# EAGLE design LT328v2 (EAGLE 7.5.0)
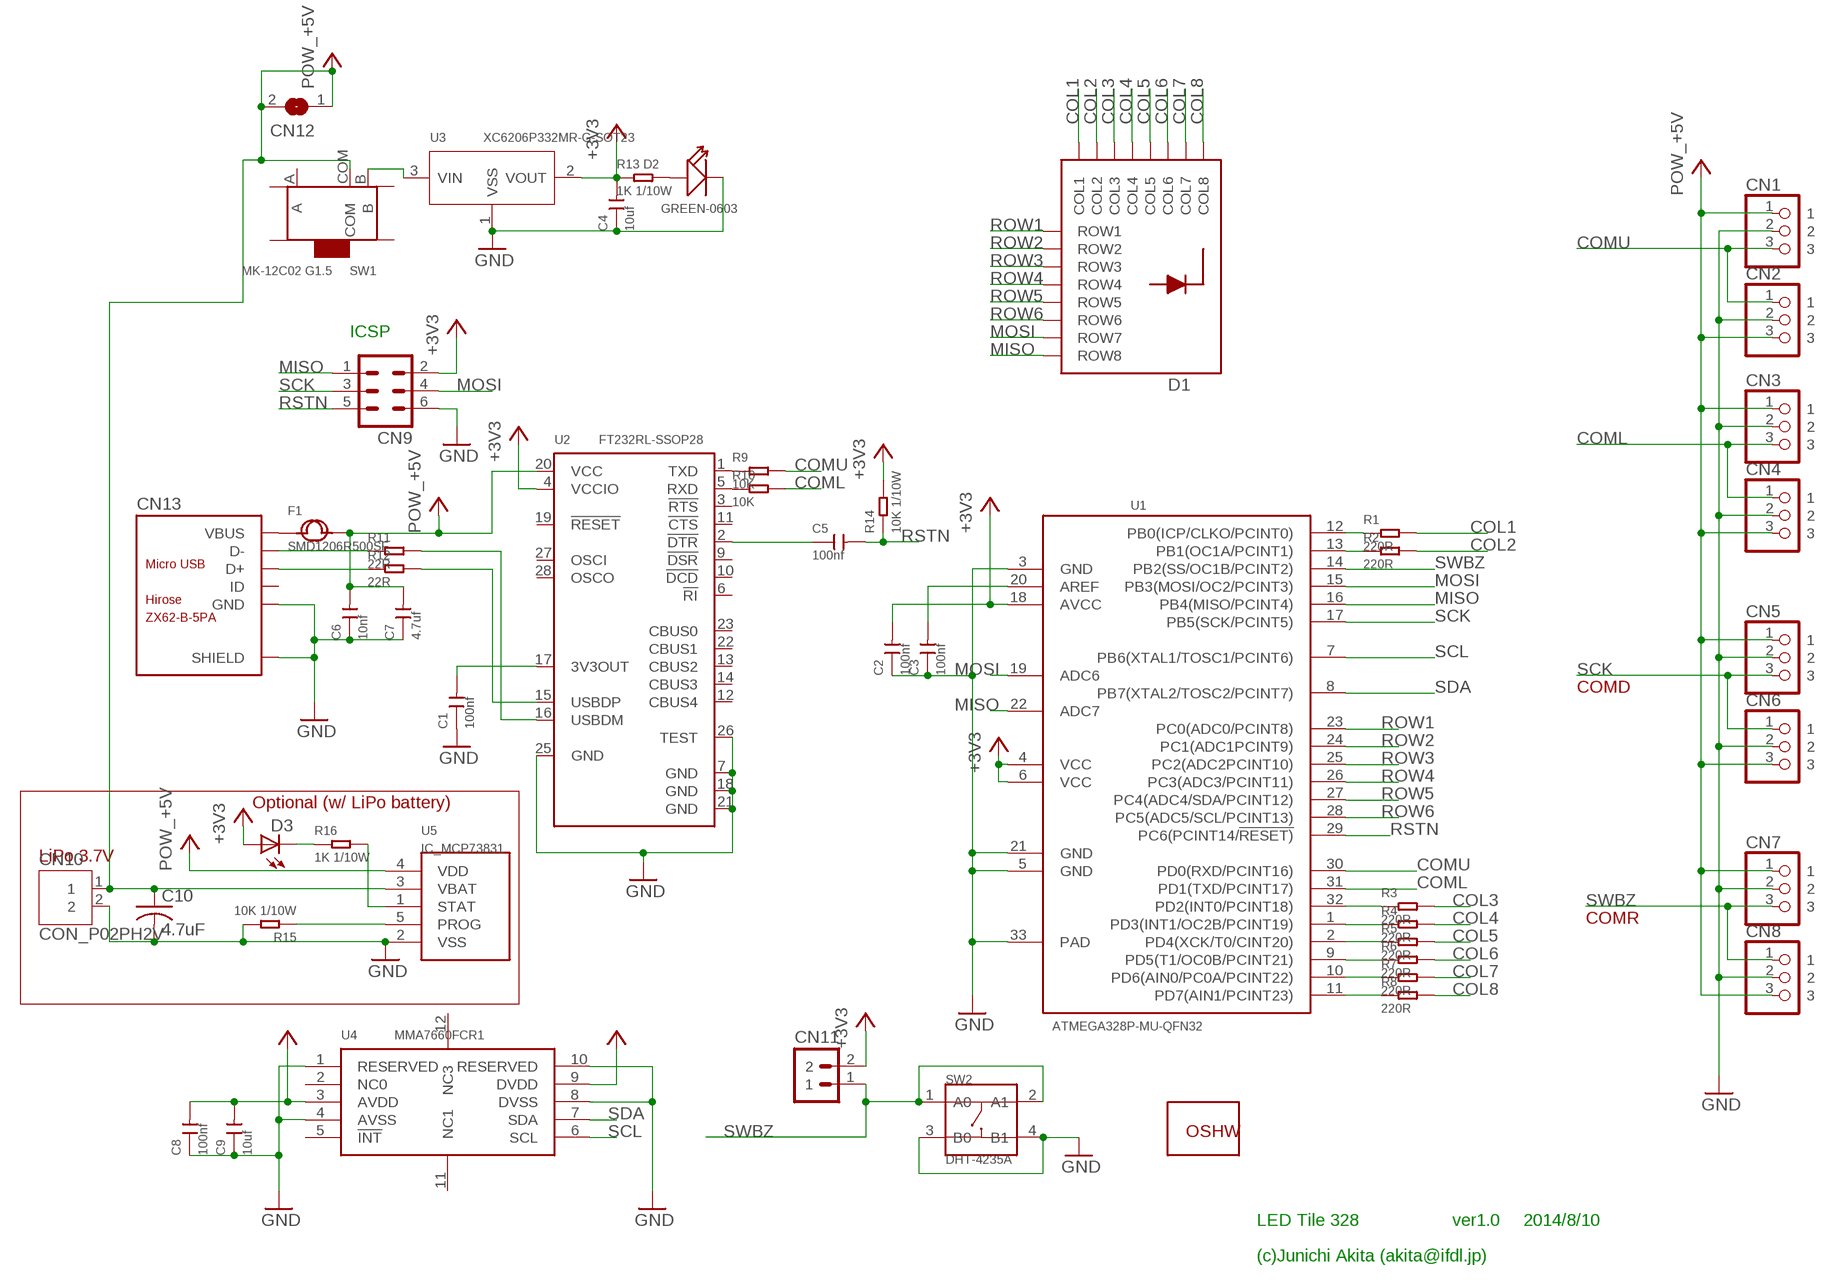
[diagram p0: schematic, sheet 1]

## Parts
C1  100nf  CERAMIC-100NF-50V-10%-X7R(0603)  [C0603]
C2  100nf  CERAMIC-100NF-50V-10%-X7R(0603)  [C0603]
C3  100nf  CERAMIC-100NF-50V-10%-X7R(0603)  [C0603]
C4  10uf  CERAMIC-10UF-10V-(-20%～+80%)-Y5V(0805)  [C0805]
C5  100nf  CERAMIC-100NF-50V-10%-X7R(0603)  [C0603]
C6  10nf  CERAMIC-10NF-50V-10%-X7R(0603)  [C0603]
C7  4.7uf  CERAMIC-4.7UF-10V-10%-X5R(0603)  [C0603]
C8  100nf  CERAMIC-100NF-50V-10%-X7R(0603)  [C0603]
C9  10uf  CERAMIC-10UF-10V-(-20%～+80%)-Y5V(0805)  [C0805]
C10  4.7uF  C-USC0603  [C0603]
CN1  CON_PINHD-1X3R  [1X03R]
CN2  CON_PINHD-1X3R  [1X03R]
CN3  CON_PINHD-1X3R  [1X03R]
CN4  CON_PINHD-1X3R  [1X03R]
CN5  CON_PINHD-1X3R  [1X03R]
CN6  CON_PINHD-1X3R  [1X03R]
CN7  CON_PINHD-1X3R  [1X03R]
CN8  CON_PINHD-1X3R  [1X03R]
CN9  MA03-2  [MA03-2]
CN10  CON_P02PH2V  [JST-PH2]
CN11  CON_PINHD-1X2PTH  [SPARKFUN_1X02]
CN12  JUMPER_SJ  [JUMPER_SJ]
CN13  ZX62-B-5PA  MICRO-USB-SMD(ZX62-B-5PA)  [MICRO-USB5+6P-SMD-0.65-AB]
D1  LED_OSL641501BRA  [TOM-1588BH]
D2  GREEN-0603  SMD-LED-CLEAR-GREEN(0603)  [LED-0603]
D3  LED0603  [SPARKFUN_LED-0603]
F1  SMD1206R500SF  SMD-PPTC-500MA(1206)  [F1206]
GOLD_ORB_SM1  OSHWLOGO_GOLD_ORB_SM  [OSHW2]
R1  220R  SMD-RES-220R-5%-1/10W(0603)  [R0603]
R2  220R  SMD-RES-220R-5%-1/10W(0603)  [R0603]
R3  220R  SMD-RES-220R-5%-1/10W(0603)  [R0603]
R4  220R  SMD-RES-220R-5%-1/10W(0603)  [R0603]
R5  220R  SMD-RES-220R-5%-1/10W(0603)  [R0603]
R6  220R  SMD-RES-220R-5%-1/10W(0603)  [R0603]
R7  220R  SMD-RES-220R-5%-1/10W(0603)  [R0603]
R8  220R  SMD-RES-220R-5%-1/10W(0603)  [R0603]
R9  10K  SMD-RES-10K-1%-1/10W(0603)  [R0603]
R10  10K  SMD-RES-10K-1%-1/10W(0603)  [R0603]
R11  22R  SMD-RES-22R-5%-1/10W(0603)  [R0603]
R12  22R  SMD-RES-22R-5%-1/10W(0603)  [R0603]
R13  1K 1/10W  SMD-RES-1K-5%-1/10W(0603)  [R0603]
R14  10K 1/10W  SMD-RES-10K-5%-1/10W(0603)  [R0603]
R15  10K 1/10W  SMD-RES-10K-5%-1/10W(0603)  [R0603]
R16  1K 1/10W  SMD-RES-1K-5%-1/10W(0603)  [R0603]
SW1  MK-12C02 G1.5  SMD-TOGGLE-SWITCH-ON-ON(3+4P-6.7X2.7MM)  [SW7-SMD-L6.7X2.7X3.2MM]
SW2  DHT-4235A  SMD-BUTTON-TOP-DHT-4235A(4P-4.2X3.2MM)  [SW4-SMD-4.2X3.2X2.5MM]
U1  ATMEGA328P-MU-QFN32  MCU-ATMEGA328P-MU(QFN32)  [QFN32G-0.5-5X5MM]
U2  FT232RL-SSOP28  INTERFACE-FT232RL(SSOP28)  [SSOP28-0.65-10.2X5.2MM]
U3  XC6206P332MR-G-SOT23  PMIC-LDO-XC6206P332MR-G(SOT23)  [SOT-23]
U4  MMA7660FCR1  MOTION/POSITION-MMA7660FCR1(DFN10)  [DFN10-0.5-3.0X3.0MM]
U5  IC_MCP73831  [SOT23-5L]

## Nets
+3V3: C2.2 C4.2 C8.2 C9.2 CN9.2 CN11.2 D3.A R13.1 R14.2 U1.4(VCC) U1.6(VCC) U1.18(AVCC) U2.4(VCCIO) U3.2(VOUT) U4.3(AVDD) U4.9(DVDD)
+5V: C6.2 C7.2 C10.1 CN1.1 CN2.3 CN3.1 CN4.3 CN5.1 CN6.3 CN7.1 CN8.3 CN10.1 CN12.1 CN12.2 F1.2 SW1.COM U2.20(VCC) U5.3(VBAT) U5.4(VDD) ; supply symbol labelled POW_+5V
COL1: D1.P$13(COL1) R1.2
COL2: D1.P$3(COL2) R2.2
COL3: D1.P$4(COL3) R3.2
COL4: D1.P$10(COL4) R4.2
COL5: D1.P$6(COL5) R5.2
COL6: D1.P$11(COL6) R6.2
COL7: D1.P$15(COL7) R7.2
COL8: D1.P$16(COL8) R8.2
COML: CN3.3 CN4.1 R10.2 U1.31(PD1(TXD/PCINT17))
COMU: CN1.3 CN2.1 R9.2 U1.30(PD0(RXD/PCINT16))
GND: C1.1 C2.1 C3.1 C4.1 C6.1 C7.1 C8.1 C9.1 C10.2 CN1.2 CN2.2 CN3.2 CN4.2 CN5.2 CN6.2 CN7.2 CN8.2 CN9.6 CN10.2 CN13.5(GND) CN13.P1(SHIELD) CN13.P2(SHIELD) CN13.P3(SHIELD) CN13.P4(SHIELD) CN13.P5(SHIELD) CN13.P6(SHIELD) D2.- R15.2 SW2.3(B0) SW2.4(B1) U1.3(GND) U1.5(GND) U1.21(GND) U1.33(PAD) U2.7(GND) U2.18(GND) U2.21(GND) U2.25(GND) U2.26(TEST) U3.1(VSS) U4.1(RESERVED) U4.4(AVSS) U4.8(DVSS) U4.10(RESERVED) U5.2(VSS)
MISO: CN9.1 D1.P$5(ROW8) U1.16(PB4(MISO/PCINT4)) U1.22(ADC7)
MOSI: CN9.4 D1.P$2(ROW7) U1.15(PB3(MOSI/OC2/PCINT3)) U1.19(ADC6)
N$1: SW1.B U3.3(VIN)
N$2: R11.2 U2.16(USBDM)
N$3: R12.2 U2.15(USBDP)
N$4: R9.1 U2.1(TXD)
N$5: C5.1 U2.2(!DTR)
N$6: C3.2 U1.20(AREF)
N$8: R10.1 U2.5(RXD)
N$9: D3.C R16.1
N$10: R16.2 U5.1(STAT)
N$11: C1.2 U2.17(3V3OUT)
N$12: D2.+ R13.2
N$13: R8.1 U1.11(PD7(AIN1/PCINT23))
N$14: R7.1 U1.10(PD6(AIN0/PC0A/PCINT22))
N$15: R6.1 U1.9(PD5(T1/OC0B/PCINT21))
N$16: R5.1 U1.2(PD4(XCK/T0/CINT20))
N$17: R4.1 U1.1(PD3(INT1/OC2B/PCINT19))
N$18: R3.1 U1.32(PD2(INT0/PCINT18))
N$20: R1.1 U1.12(PB0(ICP/CLKO/PCINT0))
N$21: R2.1 U1.13(PB1(OC1A/PCINT1))
N$25: CN13.2(D-) R11.1
N$28: CN13.3(D+) R12.1
N$45: R15.1 U5.5(PROG)
ROW1: D1.P$9(ROW1) U1.23(PC0(ADC0/PCINT8))
ROW2: D1.P$14(ROW2) U1.24(PC1(ADC1PCINT9))
ROW3: D1.P$8(ROW3) U1.25(PC2(ADC2PCINT10))
ROW4: D1.P$12(ROW4) U1.26(PC3(ADC3/PCINT11))
ROW5: D1.P$1(ROW5) U1.27(PC4(ADC4/SDA/PCINT12))
ROW6: D1.P$7(ROW6) U1.28(PC5(ADC5/SCL/PCINT13))
RSTN: C5.2 CN9.5 R14.1 U1.29(PC6(PCINT14/!RESET))
SCK: CN5.3 CN6.1 CN9.3 U1.17(PB5(SCK/PCINT5))
SCL: U1.7(PB6(XTAL1/TOSC1/PCINT6)) U4.6(SCL)
SDA: U1.8(PB7(XTAL2/TOSC2/PCINT7)) U4.7(SDA)
SWBZ: CN7.3 CN8.1 CN11.1 SW2.1(A0) SW2.2(A1) U1.14(PB2(SS/OC1B/PCINT2))
VBUS: CN13.1(VBUS) F1.1
Unconnected: CN13.4(ID) SW1.A SW1.SS1 SW1.SS2 SW1.SS3 SW1.SS4 U2.3(!RTS) U2.6(!RI) U2.9(!DSR) U2.10(!DCD) U2.11(!CTS) U2.12(CBUS4) U2.13(CBUS2) U2.14(CBUS3) U2.19(!RESET) U2.22(CBUS1) U2.23(CBUS0) U2.27(OSCI) U2.28(OSCO) U4.2(NC0) U4.5(!INT) U4.11(NC1) U4.12(NC3)

## Notes on the sheet
- ICSP
- COMD
- Optional (w/ LiPo battery)
- LiPo 3.7V
- COMR
- LED Tile 328 | ver1.0 | 2014/8/10
- (c)Junichi Akita (akita@ifdl.jp)

## Library data of the parts
C1-C3 C5 C8 = Seeed-Capacitor-2016:CERAMIC-100NF-50V-10%-X7R(0603): 302010138; MPN: CC0603KRX7R9BB104
C4 C9 = Seeed-Capacitor-2016:CERAMIC-10UF-10V-(-20%～+80%)-Y5V(0805): 302010158; MPN: CC0805ZKY5V6BB106
C6 = Seeed-Capacitor-2016:CERAMIC-10NF-50V-10%-X7R(0603): 302010140; MPN: CC0603KRX7R9BB103
C7 = Seeed-Capacitor-2016:CERAMIC-4.7UF-10V-10%-X5R(0603): 302010111; MPN: CC0603KRX5R6BB475
C10 = rcl:C-US: CAPACITOR, American symbol
CN1-CN8 = akita:CON_PINHD-1X3: PIN HEADER
CN9 = con-lstb:MA03-2: PIN HEADER; OC_FARNELL: unknown; OC_NEWARK: unknown
CN10 = akita:CON_P02
CN11 = akita:CON_PINHD-1X2: Header 2 Standard 2-pin 0.1" header. Use with straight break away headers (SKU : PRT-00116), right angle break away headers (PRT-00553), swiss pins (PRT-00743), machine pins (PRT-00117), and female headers (PRT-00115). Molex polarized connector foot print use with SKU : PRT-08233 with associated crimp pins and housings.
CN12 = akita:JUMPER_SJ: SMD solder JUMPER
CN13 = Seeed-Connector -2016:MICRO-USB-SMD(ZX62-B-5PA): 320010005; MPN: ZX62-B-5PA
D1 = akita:LED_OSL641501BRA
D2 = Seeed-LED-2016:SMD-LED-CLEAR-GREEN(0603): 304090043; MPN: 19-217-G7C-AN1P2-3T
D3 = akita:LED: LEDs Standard schematic elements and footprints for 5mm, 3mm, 1206, and 0603 sized LEDs. 5mm - Spark Fun Electronics SKU : COM-00529 (and others)
F1 = Seeed-Fuse-2016:SMD-PPTC-500MA(1206): 307010002; MPN: SMD1206R500SF
GOLD_ORB_SM1 = NBitWonder:OSHWLOGO: These are Open-Source Hardware logos.
R1-R8 = Seeed-Resistor-2016:SMD-RES-220R-5%-1/10W(0603): 301010163; MPN: RC0603JR-07220RL
R9 R10 = Seeed-Resistor-2016:SMD-RES-10K-1%-1/10W(0603): 301010299; MPN: RC0603FR-0710KL
R11 R12 = Seeed-Resistor-2016:SMD-RES-22R-5%-1/10W(0603): 301010289; MPN: RC0603JR-0722RL
R13 R16 = Seeed-Resistor-2016:SMD-RES-1K-5%-1/10W(0603): 301010291; MPN: RC0603JR-071KL
R14 R15 = Seeed-Resistor-2016:SMD-RES-10K-5%-1/10W(0603): 301010293; MPN: RC0603JR-0710KL
SW1 = Seeed-Switch-2016:SMD-TOGGLE-SWITCH-ON-ON(3+4P-6.7X2.7MM): 311030001; MPN: MK-12C02 G1.5
SW2 = Seeed-Switch-2016:SMD-BUTTON-TOP-DHT-4235A(4P-4.2X3.2MM): 311020045; MPN: DHT-4235A
U1 = Seeed-IC-2016:MCU-ATMEGA328P-MU(QFN32): 310010005; MPN: ATMEGA328P-MU
U2 = Seeed-IC-2016:INTERFACE-FT232RL(SSOP28): 310070022; MPN: FT232RL
U3 = Seeed-IC-2016:PMIC-LDO-XC6206P332MR-G(SOT23): 310030099; MPN: XC6206P332MR-G
U4 = Seeed-Sensor-2016:MOTION/POSITION-MMA7660FCR1(DFN10): 314080009; MPN: MMA7660FCR1
U5 = akita:IC_MCP73831

## Board
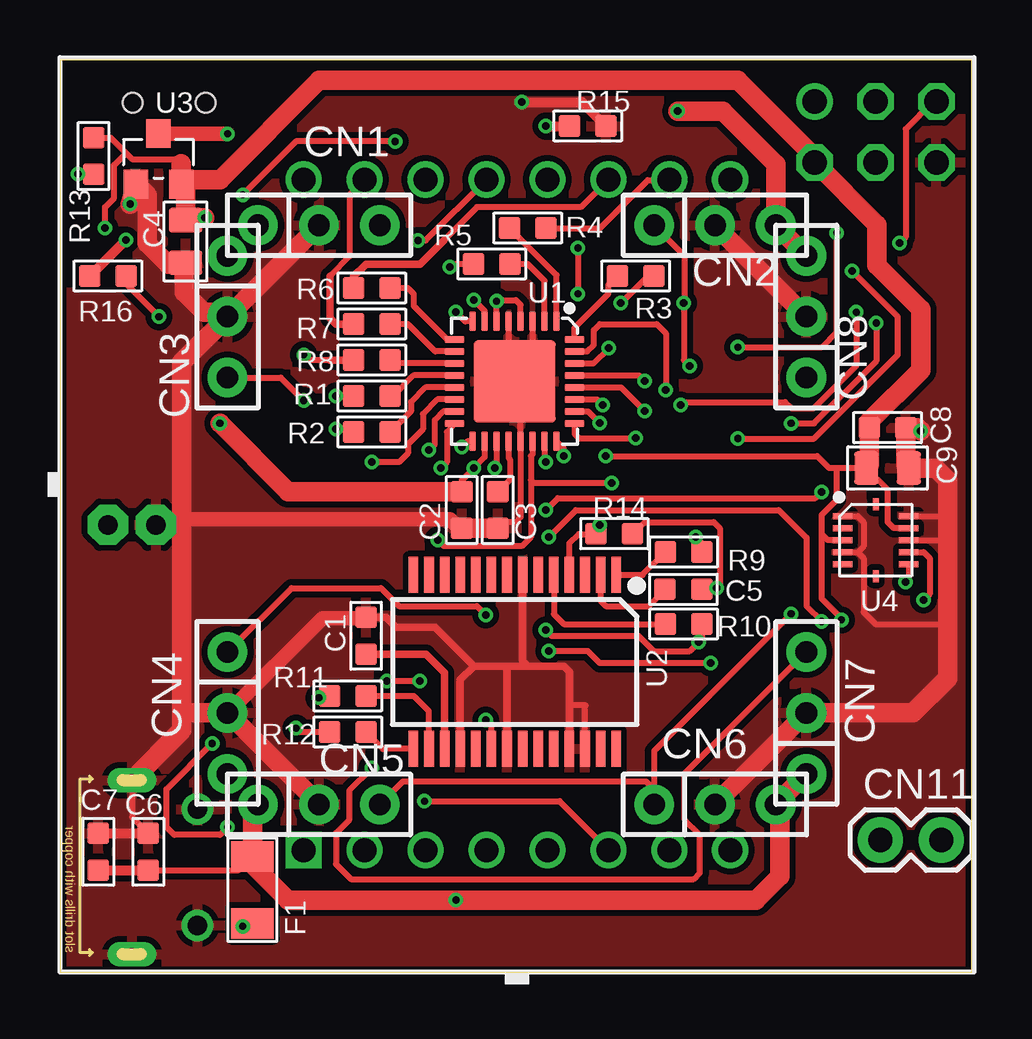
[diagram p1: board, top side]
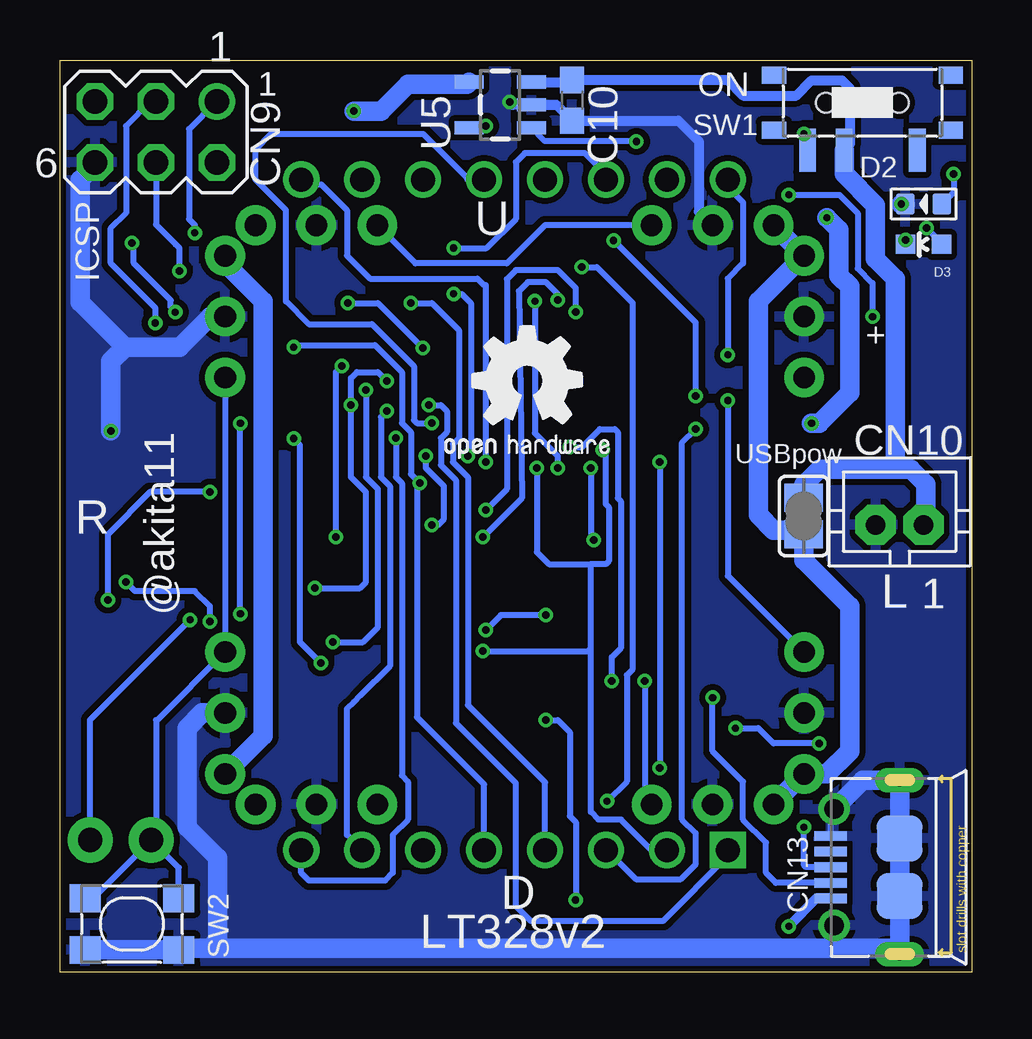
[diagram p2: board, bottom side, seen from below]

Size 38 x 38 mm. Coordinates in mm from the lower left corner, seen from the top.
Outline: 0,0 38,0 38,38 0,38 0,0
Copper layers (1*16): Top 0.035mm / dielectric 1.5mm / Bottom 0.035mm
Design rules "SeeedStudio_2layer_DRU_no_angle_20140221_Drill03mm": minimum track width 6mil, minimum drill 0.3mm, track to track 6mil, track to pad 6mil, pad to pad 6mil, via to via 6mil, smd to smd 0mil, copper to edge 10mil, drill to drill 10mil, minimum pad ring 10mil, minimum via ring 6mil, stop-mask expansion 2mil, vias tented up to drill 100mil, thermal gap 10mil

### Footprints (pad centres in the part's own frame; a part is rotated, then mirrored left to right if it is on the bottom)
C0603 = smd 0.889 x 0.889: 1 0,0.762; 2 0,-0.762
C0805 = smd 1.397 x 1.016: 1 0,0.889; 2 0,-0.889
C0603' = smd 1.1 x 1: 1 -0.85,0; 2 0.85,0
1X03R = drill 0.9 pad 1.651: 1 -2.54,0; 2 0,0; 3 2.54,0
MA03-2 = drill 1.016: 1 -2.54,-1.27 | drill 1.016 octagon: 2 -2.54,1.27; 3 0,-1.27; 4 0,1.27; 5 2.54,-1.27; 6 2.54,1.27
JST-PH2 = drill 0.813 pad 1.676 octagon: 1 1,0; 2 -1,0
SPARKFUN_1X02 = drill 1.016 pad 1.88: 1 0,0; 2 2.54,0
JUMPER_SJ = smd 1.168 x 1.6: 1 -0.762,0; 2 0.762,0
MICRO-USB5+6P-SMD-0.65-AB = smd 0.4 x 1.35: 1 -1.3,2.875; 2 -0.65,2.875; 3 0,2.875; 4 0.65,2.875; 5 1.3,2.875 | smd 1.9 x 1.9: P1 -1.2,0; P2 1.2,0 | drill 0.508 pad 1.016 long: P3 -3.625,0; P4 3.625,0 | drill 0.8: P5 -2.425,2.73; P6 2.425,2.73
TOM-1588BH = drill 1 square: P$1 10.16,5.08 | drill 1: P$2 12.7,5.08; P$3 15.24,5.08; P$4 17.78,5.08; P$5 20.32,5.08; P$6 22.86,5.08; P$7 25.4,5.08; P$8 27.94,5.08; P$9 27.94,33.02; P$10 25.4,33.02; P$11 22.86,33.02; P$12 20.32,33.02; P$13 17.78,33.02; P$14 15.24,33.02; P$15 12.7,33.02; P$16 10.16,33.02
LED-0603 = smd 0.762 x 0.889: + -0.762,0; - 0.762,0
SPARKFUN_LED-0603 = smd 0.8 x 0.8: A 0,-0.75; C 0,0.75
F1206 = smd 1.27 x 1.778: 1 -1.397,0; 2 1.397,0
R0603 = smd 0.889 x 0.889: 1 0,0.762; 2 0,-0.762
SW7-SMD-L6.7X2.7X3.2MM = smd 1.8 x 0.7: A 1.978,2.286; B 1.978,-2.286; COM 1.978,-0.762 | smd 0.7 x 1.016: SS1 -1.15,-3.683; SS2 1.15,-3.683; SS3 1.15,3.683; SS4 -1.15,3.683 | hole 0.813: 0,-1.524; 0,1.524
SW4-SMD-4.2X3.2X2.5MM = smd 1.3 x 1.15: 1 -1.95,1.075; 2 1.95,1.075; 3 -1.95,-1.075; 4 1.95,-1.075
QFN32G-0.5-5X5MM = smd 0.813 x 0.279: 1 -2.5,1.75; 2 -2.5,1.25; 3 -2.5,0.75; 4 -2.5,0.25; 5 -2.5,-0.25; 6 -2.5,-0.75; 7 -2.5,-1.25; 8 -2.5,-1.75; 17 2.5,-1.75; 18 2.5,-1.25; 19 2.5,-0.75; 20 2.5,-0.25; 21 2.5,0.25; 22 2.5,0.75; 23 2.5,1.25; 24 2.5,1.75 | smd 0.279 x 0.813: 9 -1.75,-2.5; 10 -1.25,-2.5; 11 -0.75,-2.5; 12 -0.25,-2.5; 13 0.25,-2.5; 14 0.75,-2.5; 15 1.25,-2.5; 16 1.75,-2.5; 25 1.75,2.5; 26 1.25,2.5; 27 0.75,2.5; 28 0.25,2.5; 29 -0.25,2.5; 30 -0.75,2.5; 31 -1.25,2.5; 32 -1.75,2.5 | smd 3.429 x 3.429: 33 0,0
SSOP28-0.65-10.2X5.2MM = smd 0.4 x 1.5: 1 -4.225,-3.625; 2 -3.575,-3.625; 3 -2.925,-3.625; 4 -2.275,-3.625; 5 -1.625,-3.625; 6 -0.975,-3.625; 7 -0.325,-3.625; 8 0.325,-3.625; 9 0.975,-3.625; 10 1.625,-3.625; 11 2.275,-3.625; 12 2.925,-3.625; 13 3.575,-3.625; 14 4.225,-3.625; 15 4.225,3.625; 16 3.575,3.625; 17 2.925,3.625; 18 2.275,3.625; 19 1.625,3.625; 20 0.975,3.625; 21 0.325,3.625; 22 -0.325,3.625; 23 -0.975,3.625; 24 -1.625,3.625; 25 -2.275,3.625; 26 -2.925,3.625; 27 -3.575,3.625; 28 -4.225,3.625
SOT-23 = smd 1.016 x 1.2: 1 -0.95,-1.06; 2 0.95,-1.06; 3 0,1.06
DFN10-0.5-3.0X3.0MM = smd 0.8 x 0.25: 1 -1.375,1; 2 -1.375,0.5; 3 -1.375,0; 4 -1.375,-0.5; 5 -1.375,-1; 6 1.375,-1; 7 1.375,-0.5; 8 1.375,0; 9 1.375,0.5; 10 1.375,1 | smd 0.25 x 0.5: 11 0,-1.5; 12 0,1.5
SOT23-5L = smd 0.55 x 1.2: 1 -0.95,-1.3; 2 0,-1.3; 3 0.95,-1.3; 4 0.95,1.3; 5 -0.95,1.3

### Placement (x,y rotation side)
C1  12.76,14.01 0 top
C2  16.75,19.25 180 top
C3  18.25,19.25 180 top
C4  5.24,30.44 180 top
C5  25.99,15.94 90 top
C6  3.68,5.01 0 top
C7  1.6,5.01 0 top
C8  34.5,22.68 270 top
C9  34.5,21 270 top
C10  4.7uF  [C0603']  16.65,36.32 270 bottom
CN1  10.79,31.11 0 top
CN2  27.3,31.11 0 top
CN3  6.99,27.3 270 top
CN4  6.99,10.79 270 top
CN5  10.79,6.99 0 top
CN6  27.3,6.99 0 top
CN7  31.11,10.79 90 top
CN8  31.11,27.3 90 top
CN9  34,35 180 bottom
CN10  3,18.64 0 bottom
CN11  34.2,5.5 0 top
CN12  7,19 90 bottom
CN13  3,4.37 90 bottom
D1  0,0 0 top
D2  2,32 180 bottom
D3  2,30.32 90 bottom
F1  8.03,3.42 90 top
GOLD_ORB_SM1  22.34,20.36 0 bottom
R1  13,24 270 top
R2  13,22.5 270 top
R3  24,29 90 top
R4  19.5,31 90 top
R5  18,29.5 270 top
R6  13,28.5 270 top
R7  13,27 270 top
R8  13,25.5 270 top
R9  26,17.5 90 top
R10  26,14.5 90 top
R11  12,11.5 90 top
R12  12,10 90 top
R13  1.4,34 0 top
R14  23.11,18.27 270 top
R15  22,35.25 90 top
R16  2,29 90 top
SW1  4.55,36.22 270 bottom
SW2  35,2 0 bottom
U1  18.95,24.61 270 top
U2  18.96,12.92 180 top
U3  4.11,33.88 0 top
U4  34,18 0 top
U5  19.65,36.13 90 bottom

### Tracks (layer width: path | path; a pad name or v marks a point on that pad's centre or on a via)
+3V3  (via drill 0.3)
  Top 0.254: U4.9 34.75,18.5 34.5,18.75 34.5,20.11 C9.2 32.38,21 | U4.3 32,18 31.75,18.25 | U1.4 19.2,27.8 19,28 18.25,28 v18.2,27.95 U1.6 | U1.18 17.7,21.46 17.25,21.01 v17.25,21 16.75,20.5 C2.2 | U2.4 21.23,17.86 21.62,18.25 22.33,18.25 | 22.33,18.25 22.33,18.58 v22.5,18.62 | 22.33,18.25 R14.2 | v22.75,21.5 31.57,21.5 32.07,21 32.38,21 | R13.1 2.11,34.76 2.75,34.12 | 5.06,33.62 4.81,33.88 3,33.88 2.75,34.12 | v1.88,31 1.88,31.88 2.25,32.25 2.25,33.62 2.75,34.12 | v32.58,14.67 32.58,14.73 31.75,15.56 31.75,18.25 | 31.75,18.25 31.75,19.05 32.38,19.68 32.38,21
  Top 0.813: C9.2 33.74,21.13 C8.2 33.74,22.94 35.88,25.08 35.88,27.62 34.06,29.45 34.06,31.13 CN9.2 31.46,33.95 28.26,37.15 10.79,37.15 6.67,33.02 5.26,33.02 U3.2 | U3.2 5.06,33.62 5.06,33.69 | C2.2 9.52,20.01 v6.67,22.86 | U3.2 5.24,32.65 C4.2 5.34,31.43 v6.03,31.43
  Bottom 0.254: v18.2,27.95 18.2,22.45 17.25,21.5 v17.25,21 | CN11.2 36.74,10.51 v32.58,14.67 | v22.5,18.62 22.25,18.62 22,18.88 22,20.25 22.75,21 v22.75,21.5 | D3.A 1.25,30.38 v1.88,31
  Bottom 0.813: v6.67,22.86 6.35,22.86 5.08,24.13 5.08,28.57 5.52,29.02 5.52,30.92 v6.03,31.43
+5V  (via drill 0.3)
  Top 0.254: U2.20 17.98,10.27 v17.75,10.5 | C6.2 7.45,4.25 F1.2
  Top 0.406: C7.2 C6.2
  Top 0.813: v25.75,35.88 27.62,35.88 29.84,33.66 CN2.3 CN8.3 | CN5.1 8.03,6.75 F1.2 7.88,4.82 7.88,4.62 9.5,3 15.24,3 v16.51,3 29,3 30,4 30,6.83 CN6.3 CN7.1
  Bottom 0.254: v17.75,10.5 17.25,10.5 16.75,10 16.75,6.5 16.5,6.25 v16.5,3.01 v16.51,3
  Bottom 0.406: U5.3 16.74,37.08 C10.1 10.18,37.17 9.53,36.51 7.3,36.51 6.67,37.15 5.4,37.15 5.08,36.83 5.08,34.47 SW1.COM | CN12.2 CN12.1
  Bottom 0.813: v25.75,35.88 24.62,35.88 23.5,37 21.03,37 U5.4 | CN5.1 CN4.3 6.03,8.26 5.08,9.21 5.08,15.24 7,17.16 CN12.1 7.18,18.41 8.26,18.41 8.89,19.05 8.89,27.94 CN3.1 CN1.1 | CN8.3 31.11,29.53 29.53,27.94 29.53,9.84 CN7.1 | CN12.2 7,20.3 6.35,20.95 3.17,20.95 | CN10.1 1.91,18.73 1.91,20.32 2.54,20.95 3.17,20.95 | SW1.COM 5.31,33.25 4,31.94 4,29.72 3.17,28.89 3.17,20.95
COL1  (via drill 0.3)
  Top 0.254: R1.2 v11.5,24 | v14.92,30.48 15.24,30.48 D1.P$13
  Bottom 0.254: v11.5,24 11.5,27.06 v14.92,30.48
COL2  (via drill 0.3)
  Top 0.254: v11.5,22.62 12.11,22.62 R2.2
  Bottom 0.254: D1.P$3 15.21,5.08 14,3.88 12.12,3.88 11.5,4.5 11.5,5.79 12.06,6.35 12.06,22.06 v11.5,22.62
COL3  (via drill 0.3)
  Top 0.254: R3.2 24.5,29 v23.38,27.88
  Bottom 0.254: v23.38,27.88 22.5,27.88 21.38,26.75 21.38,22.25 21.62,22 21.62,21.25 21,20.62 21,11.12 17.78,7.91 D1.P$4
COL4
  Top 0.254: D1.P$10 25.38,33 24.5,33 22.5,31 R4.2
COL5  (via drill 0.3)
  Top 0.254: R5.2 16.38,29.5 v16.25,29.38 | 22.75,5.19 D1.P$6 20.82,7.12 v15.19,7.12
  Bottom 0.254: v16.25,29.38 15.62,29.38 14.12,27.88 14.12,12.62 14.38,12.38 14.38,7.93 v15.19,7.12
COL6
  Top 0.254: D1.P$11 21.71,31.88 17.38,31.88 16,30.5
  Top 0.305: R6.2 12.24,28.99 12.75,29.5 15,29.5 16,30.5
COL7
  Top 0.254: D1.P$15 12.06,32.38 12.06,29.82 11.25,29
  Top 0.305: R7.2 11.5,27 11.25,27.25 11.25,29
COL8  (via drill 0.3)
  Top 0.254: 11.25,25.5 10.38,25.5 v10.16,25.72
  Top 0.305: R8.2 11.25,25.5
  Bottom 0.254: D1.P$16 10.16,32.7 9.53,32.07 9.53,29.53 10.16,28.89 v10.16,25.72
COML  (via drill 0.3)
  Top 0.254: U1.31 21.98,25.86 22.25,26.12 22.25,26.75 22.5,27 24.88,27 25.25,26.62 v25.25,24.25 | R10.2 26.76,13.89 v26.62,13.75 26.25,13.38 24.75,13.38 24.12,14 20.5,14 v20.25,14.25 | v17.75,14.88 17.38,15.25 14.12,15.25 13.38,16 9.65,16 CN4.1 | CN3.3 9.21,24.77 v10.16,23.81
  Bottom 0.254: v26.62,13.75 25.38,13.75 24.75,14.38 24.75,20.12 25.25,20.62 v25.25,24.25 | v17.75,14.88 19.62,14.88 v20.25,14.25 | v10.16,23.81 10.16,16.51 CN4.1
COMU  (via drill 0.3)
  Top 0.254: v22.88,26 22.23,25.36 U1.30 | R9.2 26.76,17.86 v26.5,18.12 | v26.25,25.25 26,25.5 v26,27.88 26.04,27.91 26.04,29.84 CN2.1
  Bottom 0.254: v22.88,26 24.75,27.88 v26,27.88 | v26.5,18.12 26.5,25 v26.25,25.25 | CN2.1 23.18,29.53 19.37,29.53 17.78,31.11 CN1.3
GND  (via drill 0.3)
  Top 0.254: U4.10 37,19 | U4.8 37,18 | U4.4 33.25,17.5 | U4.1 33.25,19 33.5,18.75 33.5,17.75 33.25,17.5 | 37,14.5 34,14.5 33.5,15 33.5,17.25 33.25,17.5 | U1.33 19.2,24.36 U1.21 19.2,18.95 19,18.75 18.26,18.75 C3.1 | U1.5 18.7,24.86 U1.33 | U1.3 19.7,25.36 U1.33 | 21.25,9.28 U2.25 | U2.26 21.89,11.09 21.91,11.11 21.23,11.11 | CN13.P4 3,6.45 C6.1
  Top 0.305: U2.25 21.23,11.11 21.23,12.52 21,12.75 19.5,12.75 | 19.5,12.75 18.5,12.75 | 18.5,12.75 17.25,12.75 | U2.18 16.68,12.19 17.25,12.75 | U2.21 18.64,12.62 18.5,12.75 | U2.7 19.29,12.96 19.5,12.75 | 12.74,14.75 C1.1 13.6,14.77 14,14.38 15.62,14.38 17.25,12.75
  Top 0.406: C7.1 C6.1 | v19.25,36.25 21.76,36.25 R15.2
  Top 0.61: C2.1 16.64,18.49 16.25,18.88 5.22,18.88 5.08,18.73 | 12.74,14.75 10.94,14.75 CN4.2
  Top 0.813: 35.26,22.5 C8.1 35.74,22.68 v35.88,22.54 | 35.26,22.5 35.26,21.13 C9.1 36.5,21 37,20.5 37,19 37,18 37,14.5 37,12.25 35.55,10.79 CN7.2 CN6.2 | 35.25,22.51 35.26,22.5 | C2.1 C3.1 | CN3.2 5.08,25.4 5.08,18.73 5.08,18.41 | 5.18,29.5 4.5,29.5 3.62,30.38 3.62,32.35 U3.1 3.17,32.8 v2.92,32 | 5.18,29.5 C4.1 | 5.18,29.5 5.18,28.32 6,27.5 6.79,27.5 CN3.2 | 5.08,18.41 5.08,10.79 | 5.08,10.79 5.08,10.07 CN13.P4 | CN10.2 4.86,18.64 5.08,18.41 | 5.08,10.79 CN4.2 CN5.2 | CN3.2 CN1.2 | CN2.2 CN8.2
  Bottom 0.254: CN9.6 36.54,33.71 36.5,33.67 | CN13.5 5.88,6.64 CN13.P6
  Bottom 0.406: v19.25,36.25 19.13,36.13 U5.2 17.31,36.13 C10.2 12.22,35.47 11.38,34.62 11.38,31.7 CN1.2
  Bottom 0.813: 31.75,1 32.98,1 SW2.4 SW2.3 | 31.75,1 5.71,1 | 5.71,1 3.26,1 CN13.P3 CN13.P1 CN13.P2 CN13.P4 4.53,7.99 CN13.P6 | CN13.P5 5.73,1.01 5.71,1 | CN8.2 31.75,27.3 33.02,26.04 35.28,26.04 | CN7.2 32.07,10.79 32.7,10.16 32.7,6.03 31.43,4.76 31.43,1.32 31.75,1 | 35.28,26.04 37.15,27.9 37.15,33.02 36.5,33.67 36.5,33.69 | v35.88,22.54 35.88,25.44 35.28,26.04 | D2.- v2.92,32
  pour Top (isolate 0.254): 38,38 0,38 0,0 38,0
  pour Bottom (isolate 0.254): 38,38 0,38 0,0 38,0
MISO  (via drill 0.3)
  Top 0.254: U1.22 19.7,21.57 19.62,21.5 19.62,20.5 | 19.62,20.5 19.62,18.12 19.25,17.75 16,17.75 v15.75,18 | v23,20.38 19.75,20.38 19.62,20.5 | U1.16 16.45,22.82 16.12,22.5 16.12,21.25 v15.88,21 | v28.26,26.04 31.75,26.04 32.38,26.67 v32.38,30.8
  Bottom 0.254: D1.P$5 20.32,7.82 23.12,10.62 23.12,20.25 v23,20.38 23.38,20.75 23.38,22.5 23.75,22.88 23.75,25 24.88,26.12 28.17,26.12 v28.26,26.04 | v15.88,21 15.88,18.12 v15.75,18 | CN9.1 31.48,36.27 32.62,35.12 32.62,31.38 32.38,31.14 v32.38,30.8
MOSI  (via drill 0.3)
  Top 0.254: U1.19 18.2,21.07 v18.12,21 | U1.15 15.98,23.36 15.62,23 15.62,22 v15.38,21.75 | v27.12,12.88 22.5,12.88 22,13.38 v20.38,13.38 | v28.26,22.23 31.43,22.23 34.92,25.72 34.92,27.3 v33.02,29.21
  Bottom 0.254: 15.88,13.5 15.88,6.67 15.56,6.35 14.61,6.35 13.34,5.08 D1.P$2 | 15.88,13.5 15.88,17 | 15.88,17 15.25,17 15.12,17.12 15.12,19.38 15.25,19.5 15.25,21.62 v15.38,21.75 | v18.12,21 18.12,17.5 17.62,17 15.88,17 | CN9.4 34,31.14 33.97,31.11 33.18,30.32 33.02,30.16 v33.02,29.21 | v27.12,12.88 28,13.75 28,21.97 v28.26,22.23 | v20.38,13.38 16,13.38 15.88,13.5
N$1  (via drill 0.3)
  Top 0.61: v6.99,34.92 4.12,34.92 U3.3
  Bottom 0.61: SW1.B 6.84,34.78 v6.99,34.92
N$2
  Top 0.254: U2.16 15.38,10.87 14.75,11.5 R11.2
N$3
  Top 0.254: U2.15 13.47,9.29 R12.2
N$4
  Top 0.254: U2.1 24.28,16.55 R9.1
N$5
  Top 0.254: U2.2 22.54,15.46 22.75,15.25 24.54,15.25 C5.1
N$6
  Top 0.254: U1.20 18.7,21.43 18.75,21.38 18.75,20.51 C3.2
N$8
  Top 0.254: U2.5 20.59,14.91 21,14.5 R10.1
N$9  (via drill 0.3)
  Top 0.406: v2.75,30.5 2.74,30.5 R16.1
  Bottom 0.406: D3.C v2.75,30.5
N$10  (via drill 0.3)
  Top 0.254: v13.97,34.61 9.84,34.61 v7.62,32.38 | R16.2 2.76,28.67 v4.13,27.3
  Bottom 0.254: U5.1 17.8,34.62 13.99,34.62 v13.97,34.61 | v7.62,32.38 5.51,32.38 4.75,31.62 4.75,29.32 4.13,28.7 v4.13,27.3
N$11
  Top 0.305: C1.2 15.25,13.25 16.04,12.46 U2.17
N$12  (via drill 0.3)
  Top 0.254: R13.2 0.76,33.24 v0.75,33.25
  Bottom 0.254: v0.75,33.25 0.75,32.49 D2.+
N$13
  Top 0.254: U1.11 13.9,25.36 R8.1
N$14
  Top 0.254: U1.10 15.64,25.86 14.5,27 R7.1
N$15
  Top 0.254: U1.9 16.14,26.36 14.75,27.75 14.75,28.25 14.5,28.5 R6.1
N$16
  Top 0.254: U1.2 20.2,28.8 19.5,29.5 R5.1
N$17
  Top 0.254: U1.1 20.7,29.04 R4.1
N$18
  Top 0.254: U1.32 21.45,26.85 22.86,28.26 22.86,28.62 R3.1
N$20
  Top 0.254: U1.12 14.73,24.86 13.88,24 R1.1
N$21
  Top 0.254: U1.13 15.23,24.36 14.62,23.75 14.62,23.36 R2.1
N$25  (via drill 0.3)
  Top 0.254: v10.79,11.43 11.17,11.43 R11.1
  Bottom 0.254: CN13.2 8.16,3.71 8.57,4.13 8.57,5.4 9.53,6.35 9.53,7.94 10.79,9.21 v10.79,11.43
N$28  (via drill 0.3)
  Top 0.254: v6.99,6.03 6.67,5.71 4.76,5.71 4.45,6.03 4.45,7.62 v6.35,9.53 | R12.1 10,10 v9.84,10.16
  Bottom 0.254: CN13.3 6.91,4.37 6.99,4.45 v6.99,6.03 | v6.35,9.53 8.26,9.53 8.89,10.16 v9.84,10.16
N$45  (via drill 0.3)
  Top 0.406: 20.26,35.24 21.23,35.24 R15.1
  Top 0.61: 20.26,35.24 v20.25,35.25
  Bottom 0.406: v20.25,35.25 20.88,35.25 U5.5
ROW1  (via drill 0.3)
  Top 0.254: U1.23 20.2,21.3 v20.25,21.25
  Bottom 0.254: v20.25,21.25 20.25,28.62 20.33,28.62 20.6,28.89 25.08,28.89 26.04,29.84 26.04,31.75 27.09,32.81 27.73,32.81 D1.P$9
ROW2  (via drill 0.3)
  Top 0.254: v21,21.5 21,21.81 U1.24 | v21.59,30.16 v21.59,28.26
  Bottom 0.254: D1.P$14 15.24,33.24 16.12,34.12 18.62,34.12 19,33.75 19,31.38 20.21,30.16 v21.59,30.16 | v21,21.5 20.88,21.62 20.88,27.88 21.26,28.26 v21.59,28.26
ROW3  (via drill 0.3)
  Top 0.254: U1.25 21.45,22.43 21.62,22.25 v24,22.25
  Bottom 0.254: v24,22.25 24,20.62 23.75,20.38 23.75,8.19 23.5,7.94 23.5,6.35 24.13,5.71 24.13,4.13 24.45,3.81 27.62,3.81 27.94,4.13 D1.P$8
ROW4  (via drill 0.3)
  Top 0.254: U1.26 22.02,23.36 v22.5,22.88
  Bottom 0.254: D1.P$12 20.95,33.02 | 20.95,33.02 21.02,33.02 | v22.5,22.88 23.12,22.88 23.25,23 23.25,25.25 25,27 27.64,27 28.57,27.94 28.57,31.75 29.84,33.02 29.84,34.29 29.21,34.92 22.86,34.92 20.95,33.02
ROW5  (via drill 0.3)
  Top 0.254: U1.27 22.39,23.86 v22.62,23.62
  Bottom 0.254: D1.P$1 10.16,4.84 12.88,2.12 18.38,2.12 19,2.75 19,7.88 21.5,10.38 21.5,20.5 22.12,21.12 22.12,22.25 21.88,22.5 21.88,23.38 22.12,23.62 v22.62,23.62
ROW6  (via drill 0.3)
  Top 0.254: U1.28 23.39,24.36 v24.38,23.38
  Bottom 0.254: v24.38,23.38 24.62,23.12 24.62,20.62 24.25,20.25 24.25,12.75 25.48,11.52 25.75,11.25 26.04,10.96 26.04,5.71 D1.P$7
RSTN  (via drill 0.3)
  Top 0.254: C5.2 27.32,15.94 v27.38,16 27.5,16.12 27.5,18.5 27.25,18.75 24.38,18.75 23.89,18.27 R14.1 | CN9.5 36.4,36.27 35.25,35.12 35.25,30.62 v35,30.38 | U1.29 24.14,24.86 v24.38,24.62 | v25.88,23.62 26,23.75 30.23,23.75 30.48,23.5 31.43,23.5 33.19,25.25 v33.19,27.49
  Bottom 0.254: v27.38,16 25.5,16 25.25,16.25 25.25,20 25.88,20.62 v25.88,23.62 25.88,24.75 25.62,25 24.75,25 v24.38,24.62 | v33.19,27.49 33.38,27.68 33.38,27.99 34.92,29.53 34.92,30.3 v35,30.38
SCK  (via drill 0.3)
  Top 0.254: U1.17 16.98,22.11 v16.75,21.88 | v15,12.12 v13.62,12.12 | CN5.3 14.29,7.94 24.45,7.94 24.77,7.62 | v30.48,14.92 24.77,9.21 24.77,7.62 | v30.48,22.86 31.43,22.86 34.03,25.46 v34.03,27.04 | 24.77,7.62 CN6.1
  Bottom 0.254: v16.75,21.88 16.25,21.88 15.5,22.62 14.88,22.62 14.75,22.5 14.75,19.75 14.62,19.62 14.62,13.5 15,13.12 v15,12.12 | CN9.3 34.23,36.27 35.25,35.25 35.25,31.62 35.88,31 35.88,29.53 34.02,27.67 v34.02,27.05 v34.03,27.04 | v13.62,12.12 13.62,7.28 CN5.3 | v30.48,14.92 v30.48,22.86
SCL  (via drill 0.3)
  Top 0.254: U4.6 35.38,16.38 v35.25,16.25 | U1.7 17.7,27.55 v17.25,28 | v20.38,18.12 21.5,19.25 29.96,19.25 31.11,18.1 31.11,15.24 v31.75,14.61
  Bottom 0.254: v17.25,28 17.25,28.25 17.75,28.75 18.5,28.75 18.88,28.38 18.75,19.75 v20.38,18.12 | v31.75,14.61 31.75,15.24 32.38,15.88 34.88,15.88 v35.25,16.25
SDA  (via drill 0.3)
  Top 0.254: U4.7 36,17.5 36.25,17.25 36.25,15.75 v36,15.5 | U1.8 16.89,27.11 v16.5,27.5 | v20.25,19.25 20.75,19.75 31.5,19.75 v31.75,20
  Bottom 0.254: v16.5,27.5 16.5,28.5 17.25,29.25 19,29.25 19.38,28.88 19.38,20.12 v20.25,19.25 | v36,15.5 36,18.25 34.25,20 v31.75,20
SWBZ  (via drill 0.3)
  Top 0.254: U1.14 15.73,23.86 15.12,23.25 15.12,22.62 14.5,22 14.5,21.62 14.12,21.25 v13,21.25 | CN7.3 26.04,8.26 26.04,6.35 26.67,5.71 26.67,4.13 26.42,3.88 12.12,3.88 11.5,4.5 11.5,5.79 12.06,6.35 12.06,7.57 v13,8.5
  Bottom 0.254: CN11.1 34,5.7 34,10.5 33.95,10.5 CN7.3 CN8.1 | CN11.1 36.62,3.08 SW2.1 | v13,21.25 v13,8.5 | SW2.2 33.05,4.35 CN11.1
VBUS  (via drill 0.3)
  Top 0.406: v7.62,1.91 7.9,1.91 F1.1
  Bottom 0.406: CN13.1 6.46,3.06 v7.62,1.91

### Text on the board
bPlace: ON | 1 | ICSP | U | + | @akita11 | USBpow | R | L | D | LT328v2